# Altium schematic sheet Headers.SchDoc
size A; SheetNumber: 3; SheetTotal: 4
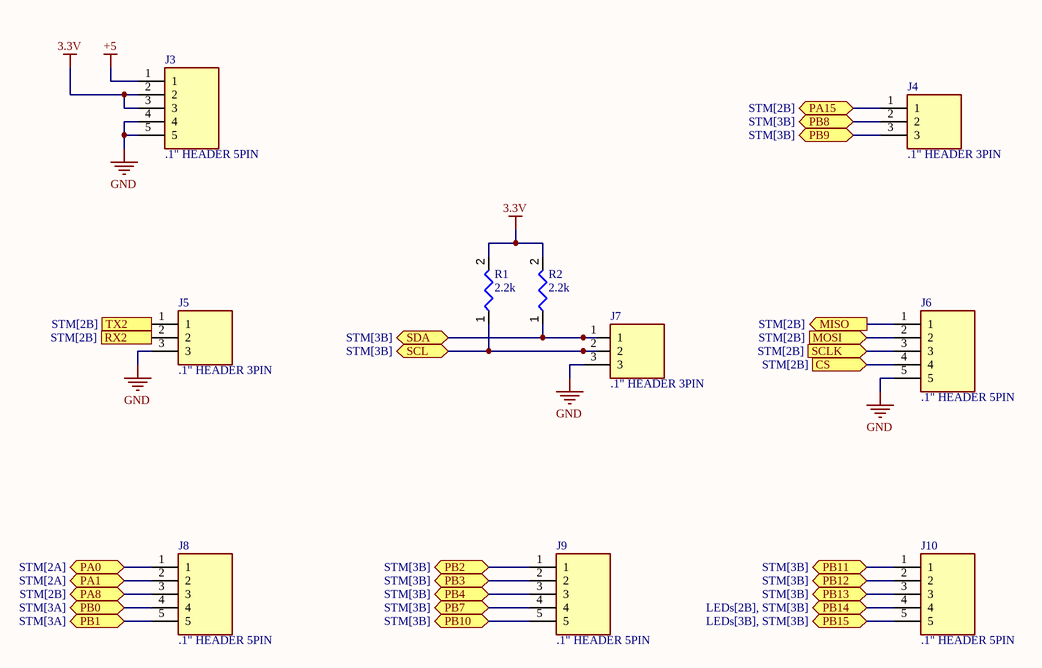
[diagram p0: Headers.SchDoc]

## Parts
J3  .1" HEADER 5PIN  [HDRV5W64P0X254_1X5_1270X250X850P]  (no BOM)
J4  .1" HEADER 3PIN  [HDRV3W64P0X254_1X3_762X250X952P]  (no BOM)
J5  .1" HEADER 3PIN  [HDRV3W64P0X254_1X3_762X250X952P]  (no BOM)
J6  .1" HEADER 5PIN  [HDRV5W64P0X254_1X5_1270X250X850P]  (no BOM)
J7  .1" HEADER 3PIN  [HDRV3W64P0X254_1X3_762X250X952P]  (no BOM)
J8  .1" HEADER 5PIN  [HDRV5W64P0X254_1X5_1270X250X850P]  (no BOM)
J9  .1" HEADER 5PIN  [HDRV5W64P0X254_1X5_1270X250X850P]  (no BOM)
J10  .1" HEADER 5PIN  [HDRV5W64P0X254_1X5_1270X250X850P]  (no BOM)
R1  value 2.2k  [RES_0603]  (hidden comment: RES 2.2k)
R2  value 2.2k  [RES_0603]  (hidden comment: RES 2.2k)

## Ports
CS (in, see STM[2B]), MISO (out, see STM[2B]), MOSI (in, see STM[2B]), PA0 (bidir, see STM[2A]), PA1 (bidir, see STM[2A]), PA8 (bidir, see STM[2B]), PA15 (bidir, see STM[2B]), PB0 (bidir, see STM[3A]), PB1 (bidir, see STM[3A]), PB2 (bidir, see STM[3B]), PB3 (bidir, see STM[3B]), PB4 (bidir, see STM[3B]), PB7 (bidir, see STM[3B]), PB8 (bidir, see STM[3B]), PB9 (bidir, see STM[3B]), PB10 (bidir, see STM[3B]), PB11 (bidir, see STM[3B]), PB12 (bidir, see STM[3B]), PB13 (bidir, see STM[3B]), PB14 (bidir, see LEDs[2B], STM[3B]), PB15 (bidir, see LEDs[3B], STM[3B]), RX2 (out, see STM[2B]), SCL (bidir, see STM[3B]), SCLK (in, see STM[2B]), SDA (bidir, see STM[3B]), TX2 (in, see STM[2B])

## Nets
3.3V: J3.2 J3.3 R1.2 R2.2
+5: J3.1
GND: J3.4 J3.5 J5.3 J6.5 J7.3
CS: J6.4 ; port CS
MISO: J6.1 ; port MISO
MOSI: J6.2 ; port MOSI
PA0: J8.1 ; port PA0
PA1: J8.2 ; port PA1
PA8: J8.3 ; port PA8
PA15: J4.1 ; port PA15
PB0: J8.4 ; port PB0
PB1: J8.5 ; port PB1
PB2: J9.1 ; port PB2
PB3: J9.2 ; port PB3
PB4: J9.3 ; port PB4
PB7: J9.4 ; port PB7
PB8: J4.2 ; port PB8
PB9: J4.3 ; port PB9
PB10: J9.5 ; port PB10
PB11: J10.1 ; port PB11
PB12: J10.2 ; port PB12
PB13: J10.3 ; port PB13
PB14: J10.4 ; port PB14
PB15: J10.5 ; port PB15
RX2: J5.2 ; port RX2
SCL: J7.2 R1.1 ; port SCL
SCLK: J6.3 ; port SCLK
SDA: J7.1 R2.1 ; port SDA
TX2: J5.1 ; port TX2

## Library data of the parts
J3 J6 J8-J10 = CMP-00039-1: Connector; Source: SamacSys.SchLib; Design Item ID: .1" HEADER 5PIN
J4 J5 J7 = CMP-00038-1: Connector; Design Item ID: .1" HEADER 3PIN; Source: SamacSys.SchLib
R1 R2 = CMP-009-00804-1: Resistor 2.2k 5% 100 mW 0603; Power: 100mW; Source: Generic_Schematic_Library.SchLib; Tolerance: 5%; Design Item ID: RES 2.2k